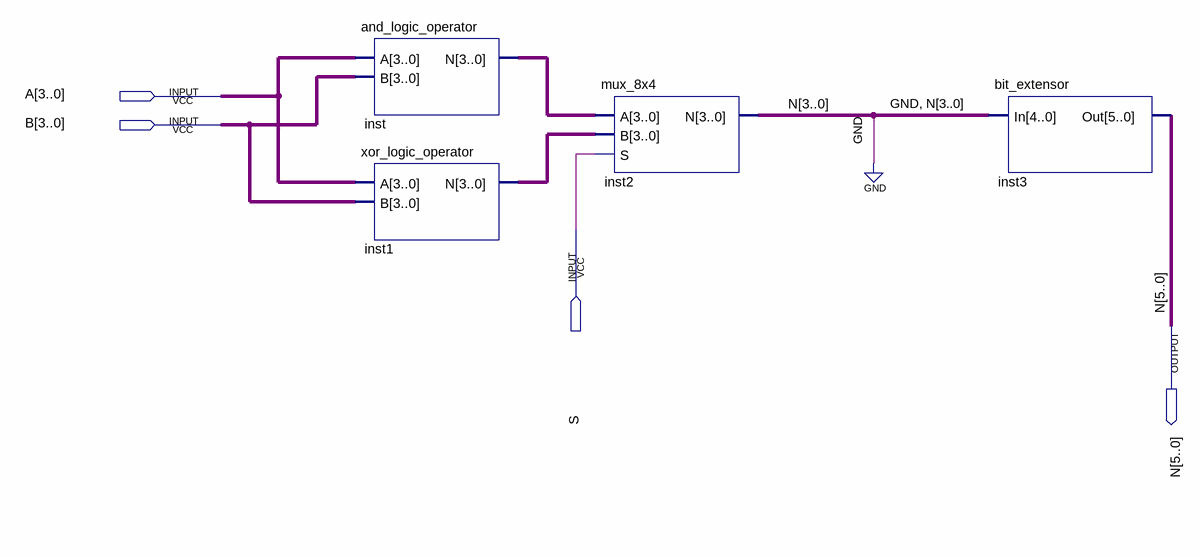
[diagram p0: schematic sheet]
// Quartus schematic logic_unit.bdf as structural Verilog: 4 symbols, 4 pins
module logic_unit (
  input  [3:0] A,
  input  [3:0] B,
  input  S,
  output [5:0] N
);

  wire [3:0] inst1_n, inst_n;

  and_logic_operator inst (.A(A), .B(B), .N(inst_n));
  xor_logic_operator inst1 (.A(A), .B(B), .N(inst1_n));
  mux_8x4 inst2 (.A(inst_n), .B(inst1_n), .S(S), .N(N[3:0]));
  bit_extensor inst3 (.In({1'b0, N[3:0]}), .Out(N));
endmodule
